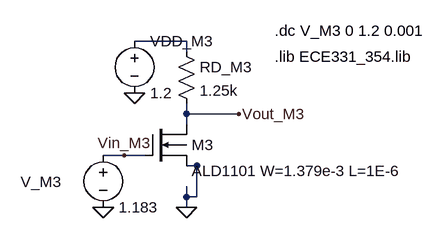
[diagram p0: schematic dc_sweep_M3.asc]
dc_sweep_M3.asc, the LTspice schematic file:
Version 4
SHEET 1 1052 680
WIRE 320 -32 240 -32
WIRE 320 -16 320 -32
WIRE 320 80 320 64
WIRE 400 80 320 80
WIRE 320 96 320 80
WIRE 224 144 192 144
WIRE 256 144 224 144
WIRE 336 160 320 160
WIRE 320 208 320 192
WIRE 336 208 336 160
WIRE 336 208 320 208
WIRE 320 224 320 208
FLAG 240 48 0
FLAG 320 224 0
FLAG 192 224 0
FLAG 400 80 Vout_M3
FLAG 224 144 Vin_M3
SYMBOL ECE331\\ALD1101 256 96 R0
SYMATTR InstName M3
SYMBOL voltage 240 -48 R0
WINDOW 123 0 0 Left 0
WINDOW 39 0 0 Left 0
SYMATTR InstName VDD_M3
SYMATTR Value 1.2
SYMBOL res 304 -32 R0
SYMATTR InstName RD_M3
SYMATTR Value 1.25k
SYMBOL voltage 192 128 R0
WINDOW 123 0 0 Left 0
WINDOW 39 0 0 Left 0
WINDOW 0 -127 57 Left 2
SYMATTR InstName V_M3
SYMATTR Value 1.183
TEXT 456 -48 Left 2 !.dc V_M3 0 1.2 0.001
TEXT 456 -8 Left 2 !.lib ECE331_354.lib

The netlist it stands for:
* dc_sweep_M3.asc
M3 Vout_M3 Vin_M3 0 0 ALD1101 W=1.379e-3 L=1E-6
VDD_M3 N001 0 1.2
RD_M3 N001 Vout_M3 1.25k
V_M3 Vin_M3 0 1.183
.model NMOS NMOS
.model PMOS PMOS
.lib standard.mos
.dc V_M3 0 1.2 0.001
.lib ECE331_354.lib
.backanno
.end

* Results of the author's LTspice run, read from the files saved beside the schematic
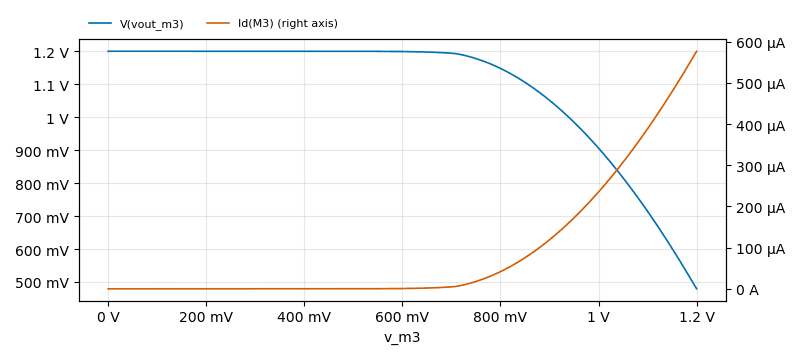
[diagram p1: DC transfer characteristic of dc_sweep_M3.asc, plotted from the saved traces]
* DC transfer characteristic, 1 run:
*   V(vout_m3): 1.2 V at v_m3=0 V, 479.2 mV at v_m3=1.2 V, min 479.2 mV, max 1.2 V
*   Id(M3): 12.77 pA at v_m3=0 V, 576.6 µA at v_m3=1.2 V, min 12.77 pA, max 576.6 µA